# EAGLE schematic SQR_FG (EAGLE 7.2.0)
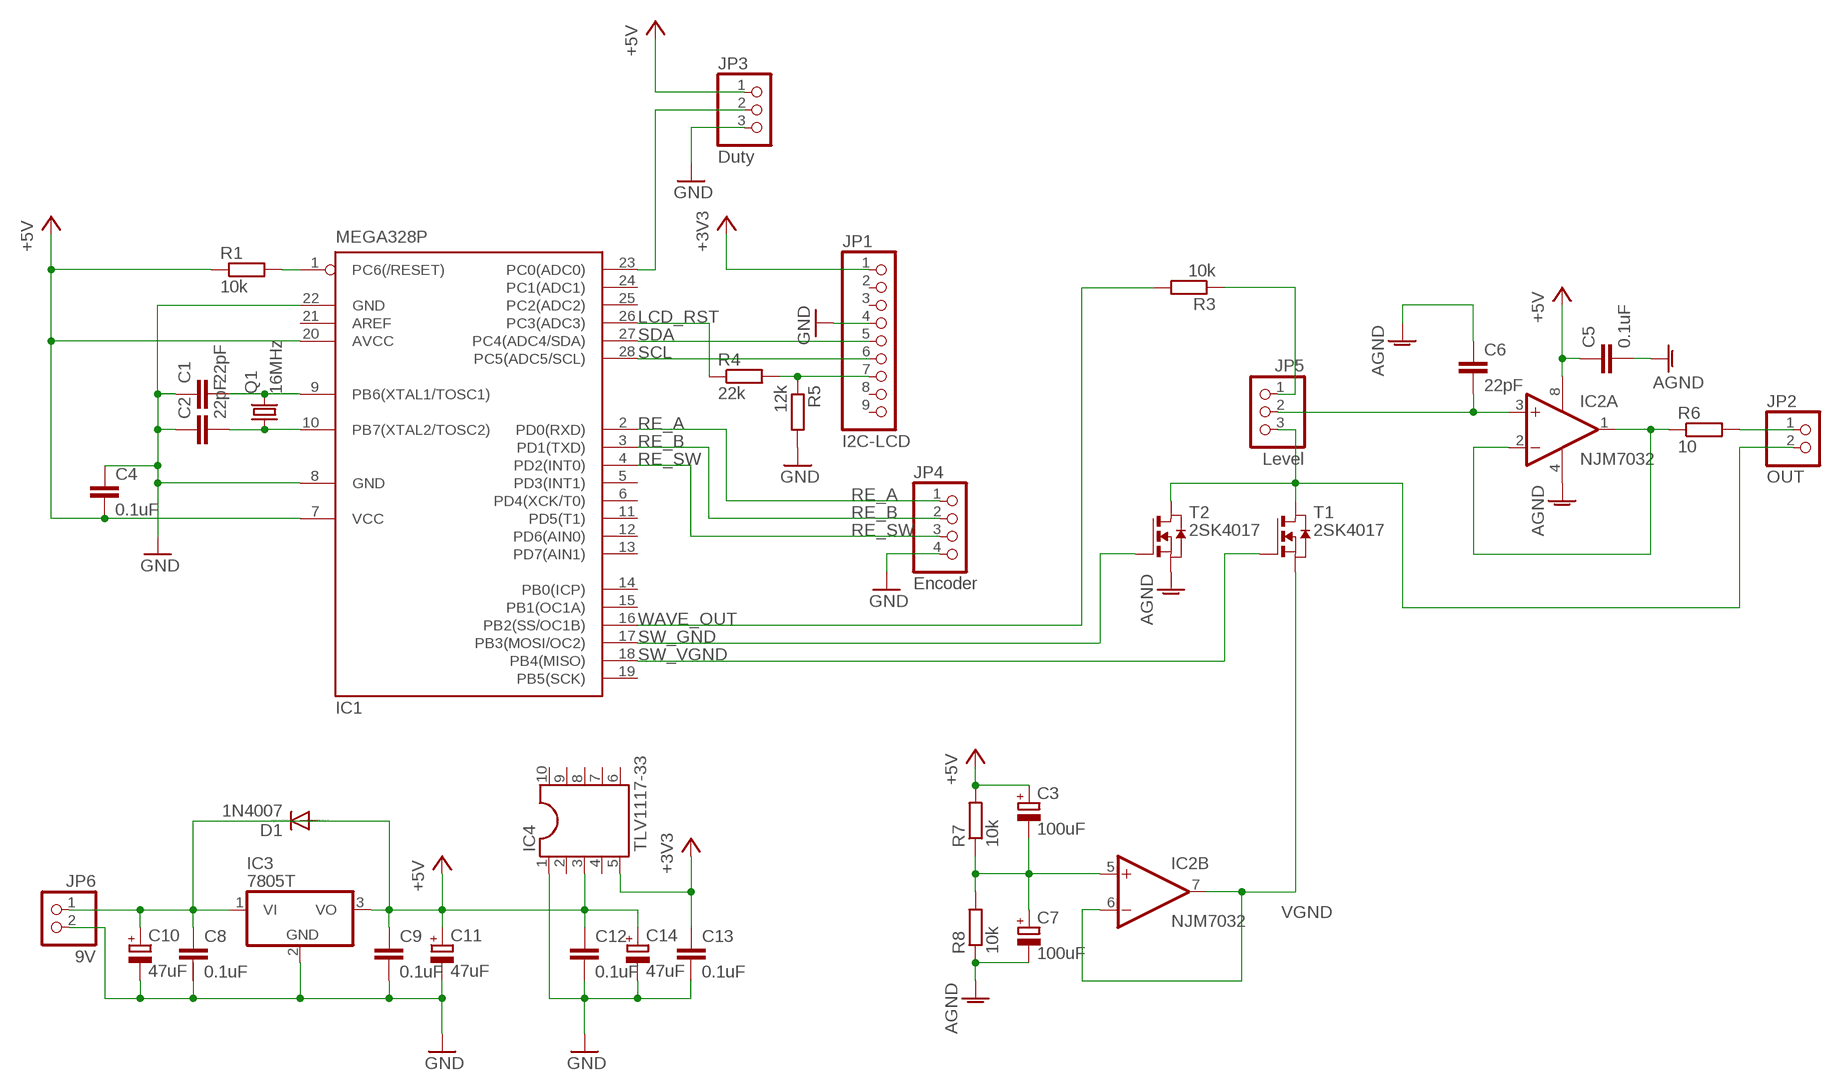
[diagram p0: schematic, sheet 1]

## Parts
C1  22pF  C-EU025-024X044  [C025-024X044]
C2  22pF  C-EU025-024X044  [C025-024X044]
C3  100uF  CPOL-EUE2.5-5  [E2,5-5]
C4  0.1uF  C-EU025-024X044  [C025-024X044]
C5  0.1uF  C-EU025-024X044  [C025-024X044]
C6  22pF  C-EU025-024X044  [C025-024X044]
C7  100uF  CPOL-EUE2.5-5  [E2,5-5]
C8  0.1uF  C-EU025-024X044  [C025-024X044]
C9  0.1uF  C-EU025-024X044  [C025-024X044]
C10  47uF  CPOL-EUTT2D5L  [TT2D5L]
C11  47uF  CPOL-EUTT2D5L  [TT2D5L]
C12  0.1uF  C-EU025-024X044  [C025-024X044]
C13  0.1uF  C-EU025-024X044  [C025-024X044]
C14  47uF  CPOL-EUTT2D5L  [TT2D5L]
D1  1N4007  1N4004  [DO41-10]
IC1  MEGA328P  MEGA8-P  [DIL28-3]
IC2  NJM7032  LM358N  [DIL08]
IC3  7805T  [TO220H]
IC4  TLV1117-33  DIL10  [DIL10]
JP1  I2C-LCD  PINHD-1X9  [1X09]
JP2  OUT  PINHD-1X2  [1X02]
JP3  Duty  PINHD-1X3  [1X03]
JP4  Encoder  PINHD-1X4  [1X04]
JP5  Level  PINHD-1X3  [1X03]
JP6  9V  PINHD-1X2  [1X02]
Q1  16MHz  CRYSTALHC49S  [HC49/S]
R1  10k  R-EU_0207/7  [0207/7]
R3  10k  R-EU_0207/7  [0207/7]
R4  22k  R-EU_0207/7  [0207/7]
R5  12k  R-EU_0207/7  [0207/7]
R6  10  R-EU_0207/7  [0207/7]
R7  10k  R-EU_0207/7  [0207/7]
R8  10k  R-EU_0207/7  [0207/7]
T1  2SK4017  NMOSE3L  [E3LINE]
T2  2SK4017  NMOSE3L  [E3LINE]

## Nets
+3V3: C13.1 IC4.5 JP1.1
+5V: C3.+ C4.2 C5.1 C8.1 C9.1 C10.+ C11.+ C12.1 C14.+ IC1.7(VCC) IC1.20(AVCC) IC2.8(P:V+) IC3.1(VI) IC3.3(VO) IC4.3 JP3.1 JP6.1 R1.1 R7.2
AGND: C5.2 C6.1 C7.- IC2.4(P:V-) R8.1 T2.3(S)
GND: C1.1 C2.1 C4.1 C8.2 C9.2 C10.- C11.- C12.2 C13.2 C14.- IC1.8(GND) IC1.22(GND) IC3.2(GND) IC4.1 JP1.4 JP3.3 JP4.4 JP6.2 R5.2
LCD_RST: IC1.26(PC3(ADC3)) R4.1
N$1: C1.2 IC1.9(PB6(XTAL1/TOSC1)) Q1.2
N$2: C2.2 IC1.10(PB7(XTAL2/TOSC2)) Q1.1
N$3: IC1.1(PC6(/RESET)) R1.2
N$6: JP2.2 JP5.3 T1.1(D) T2.1(D)
N$8: JP5.1 R3.1
N$9: IC1.23(PC0(ADC0)) JP3.2
N$11: JP2.1 R6.2
N$15: C6.2 IC2.3(A:+IN) JP5.2
N$16: IC2.1(A:OUT) IC2.2(A:-IN) R6.1
N$17: C3.- C7.+ IC2.5(B:+IN) R7.1 R8.2
RE_A: IC1.2(PD0(RXD)) JP4.1
RE_B: IC1.3(PD1(TXD)) JP4.2
RE_SW: IC1.4(PD2(INT0)) JP4.3
RST: JP1.7 R4.2 R5.1
SCL: IC1.28(PC5(ADC5/SCL)) JP1.6
SDA: IC1.27(PC4(ADC4/SDA)) JP1.5
SW_GND: IC1.17(PB3(MOSI/OC2)) T2.2(G)
SW_VGND: IC1.18(PB4(MISO)) T1.2(G)
VGND: IC2.6(B:-IN) IC2.7(B:OUT) T1.3(S)
WAVE_OUT: IC1.16(PB2(SS/OC1B)) R3.2
Unconnected: D1.A D1.C IC1.5(PD3(INT1)) IC1.6(PD4(XCK/T0)) IC1.11(PD5(T1)) IC1.12(PD6(AIN0)) IC1.13(PD7(AIN1)) IC1.14(PB0(ICP)) IC1.15(PB1(OC1A)) IC1.19(PB5(SCK)) IC1.21(AREF) IC1.24(PC1(ADC1)) IC1.25(PC2(ADC2)) IC4.2 IC4.4 IC4.6 IC4.7 IC4.8 IC4.9 IC4.10 JP1.2 JP1.3 JP1.8 JP1.9

## Library data of the parts
C1 C2 C4-C6 C8 C9 C12 C13 = rcl:C-EU: CAPACITOR, European symbol
C3 C7 C10 C11 C14 = rcl:CPOL-EU: POLARIZED CAPACITOR, European symbol
D1 = diode:1N4004: DIODE general purpose rectifier, 1 A
IC1 = atmel:MEGA8-P: MICROCONTROLLER 8 Kbytes FLASH, 1 kbytes SRAM, 512 bytes EEPROM, USART, 4-channel 10 bit ADC, 2-channel 8 bit ADC Pin compatible with Atmega48, ATMega88, ATMega168 Source: avr.lbr; OC_FARNELL: unknown; OC_NEWARK: unknown
IC2 = linear:LM358: OP AMP also LM158; LM258; LM2904 Source: http://cache.national.com/ds/LM/LM158.pdf
IC3 = linear:78*: Positive VOLTAGE REGULATOR Source: http://cache.national.com/ds/LM/LM78L05.pdf http://www.fairchildsemi.com/ds/LM/LM7805.pdf
IC4 = ic-package:DIL10: Dual In Line / Socket
JP1 = pinhead:PINHD-1X9: PIN HEADER
JP2 JP6 = pinhead:PINHD-1X2: PIN HEADER
JP3 JP5 = pinhead:PINHD-1X3: PIN HEADER
JP4 = pinhead:PINHD-1X4: PIN HEADER
Q1 = crystal:CRYSTAL: CRYSTAL; OC_FARNELL: 1667008; OC_NEWARK: unknown
R1 R3-R8 = rcl:R-EU_: RESISTOR, European symbol
T1 T2 = zetex:NMOSE3L: MOS FET; OC_FARNELL: unknown; OC_NEWARK: unknown